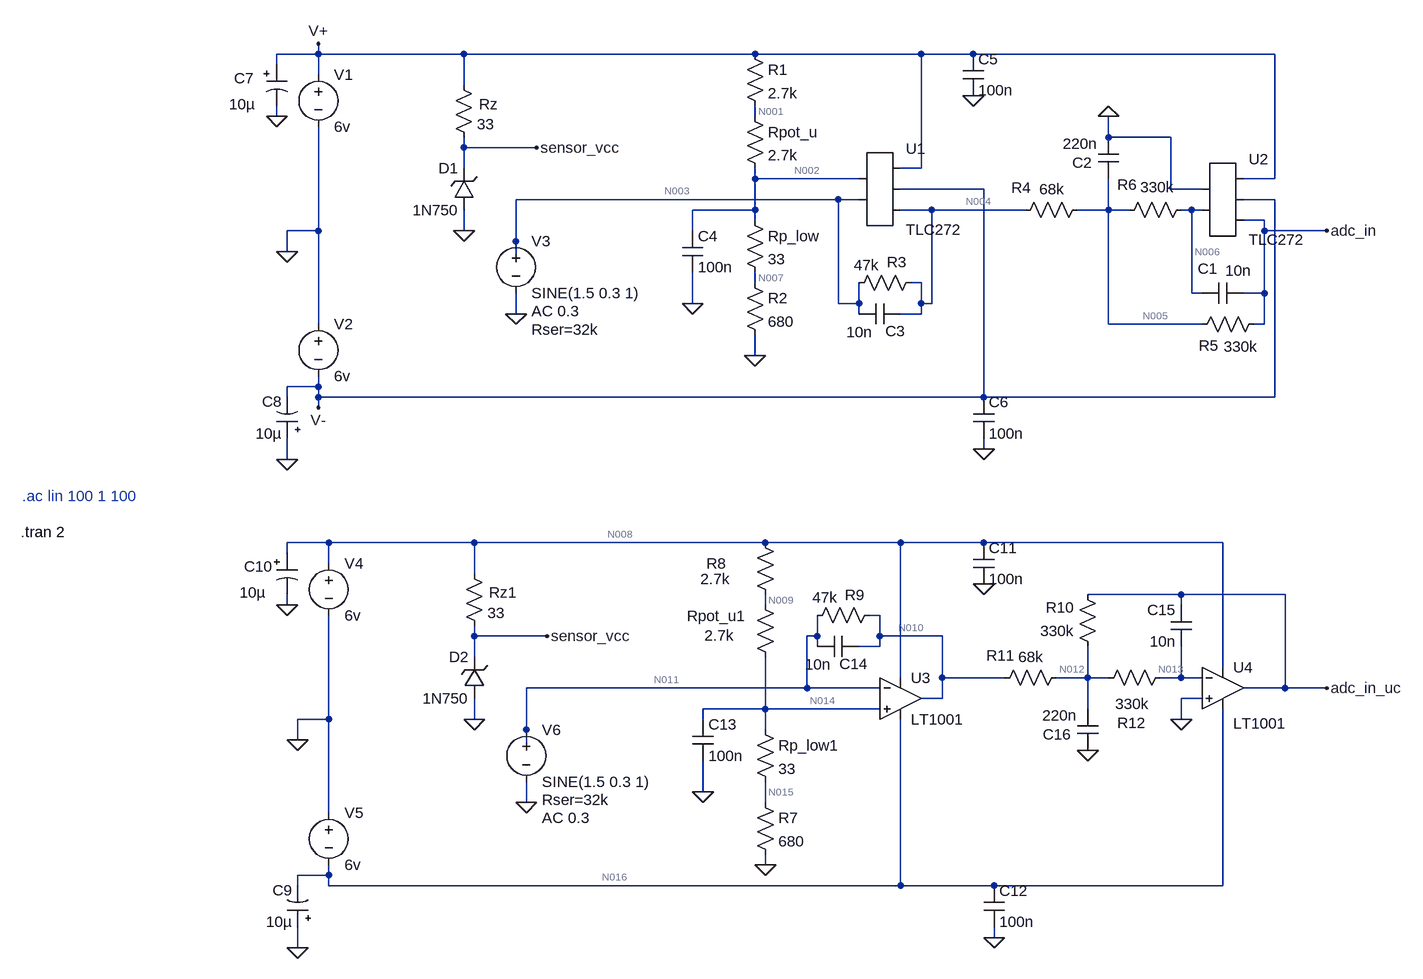
[diagram p0: schematic acceleration_measurement_lab2.asc]
* acceleration_measurement_lab2.asc
* U1: TLC272 (symbol AutoGenerated\TLC272 not available, pins judged from their places): pin1=N002 pin2=N003 pin3=V+ pin4=V- pin5=N004
* U2: TLC272 (symbol AutoGenerated\TLC272 not available, pins judged from their places): pin1=0 pin2=N006 pin3=V+ pin4=V- pin5=adc_in
D1 0 sensor_vcc 1N750
Rz V+ sensor_vcc 33
V1 V+ 0 6v
V2 0 V- 6v
V3 N003 0 SINE(1.5 0.3 1) AC 0.3 Rser=32k
C8 0 V- 10µ
C7 V+ 0 10µ
C5 V+ 0 100n
C6 V- 0 100n
R2 N007 0 680
Rp_low N002 N007 33
R1 V+ N001 2.7k
Rpot_u N001 N002 2.7k
C4 N002 0 100n
R3 N004 N003 47k
C3 N004 N003 10n
R5 adc_in N005 330k
R4 N005 N004 68k
R6 N006 N005 330k
C1 adc_in N006 10n
C2 N005 0 220n
D2 0 sensor_vcc 1N750
Rz1 N008 sensor_vcc 33
V4 N008 0 6v
V5 0 N016 6v
V6 N011 0 SINE(1.5 0.3 1) AC 0.3 Rser=32k
C9 0 N016 10µ
C10 N008 0 10µ
C11 N008 0 100n
C12 N016 0 100n
R7 N015 0 680
Rp_low1 N014 N015 33
R8 N008 N009 2.7k
Rpot_u1 N009 N014 2.7k
C13 N014 0 100n
R9 N010 N011 47k
C14 N010 N011 10n
R10 N012 adc_in_uc 330k
R11 N012 N010 68k
R12 N013 N012 330k
C15 N013 adc_in_uc 10n
C16 0 N012 220n
XU3 N014 N011 N008 N016 N010 LT1001  ; pins In+ In- V+ V- OUT
XU4 0 N013 N008 N016 adc_in_uc LT1001  ; pins In+ In- V+ V- OUT
.model D D
.lib standard.dio
* .ac lin 100 1 100
.tran 2
.lib LTC.lib
.backanno
.end

* Results of the author's LTspice run, read from the files saved beside the schematic
* Operating Point, zero values left out:
*   V(n004) = -478.1 mV
*   V(v-) = -6 V
*   V(v+) = 6 V
*   V(n003) = 698.7 mV
*   V(n002) = 699.8 mV
*   V(adc_in) = 2.314 V
*   V(n006) = -1.129 mV
*   V(sensor_vcc) = 4.735 V
*   V(n007) = 667.4 mV
*   V(n001) = 3.35 V
*   V(n005) = -1.129 mV
*   V(n008) = 6 V
*   V(n016) = -6 V
*   V(n011) = 699.8 mV
*   V(n015) = 667.4 mV
*   V(n014) = 699.8 mV
*   V(n009) = 3.35 V
*   V(n010) = -475.4 mV
*   V(n012) = -3.106 µV
*   V(adc_in_uc) = 2.307 V
*   V(n013) = -3.092 µV
*   I(D2) = -38.33 mA
*   I(D1) = -38.33 mA
*   I(R11) = 6.992 µA
*   I(R10) = -6.992 µA
*   I(R9) = -25.01 µA
*   I(Rpot_u1) = 981.5 µA
*   I(R8) = 981.5 µA
*   I(Rp_low1) = 981.5 µA
*   I(R7) = 981.5 µA
*   I(Rz1) = 38.33 mA
*   I(R6) = -1.724 pA
*   I(R4) = 7.015 µA
*   I(R5) = 7.015 µA
*   I(R3) = -25.04 µA
*   I(Rpot_u) = 981.5 µA
*   I(R1) = 981.5 µA
*   I(Rp_low) = 981.5 µA
*   I(R2) = 981.5 µA
*   I(Rz) = 38.33 mA
*   I(V6) = -25.01 µA
*   I(V5) = -4.513 mA
*   I(V4) = -43.8 mA
*   I(V3) = -25.04 µA
*   I(V2) = -1.9 mA
*   I(V1) = -41.21 mA
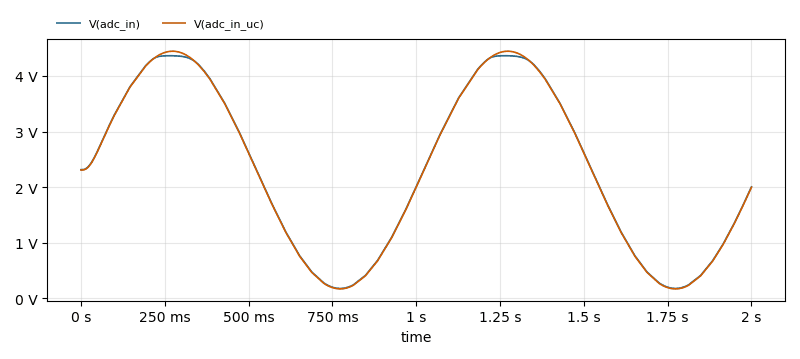
[diagram p1: Transient Analysis of acceleration_measurement_lab2.asc, plotted from the saved traces]
* Transient Analysis, 1 run:
*   V(adc_in): min 177.6 mV, max 4.363 V, average 2.309 V, rms 2.757 V, last 2.004 V
*   V(adc_in_uc): min 170.6 mV, max 4.444 V, average 2.309 V, rms 2.762 V, last 1.998 V